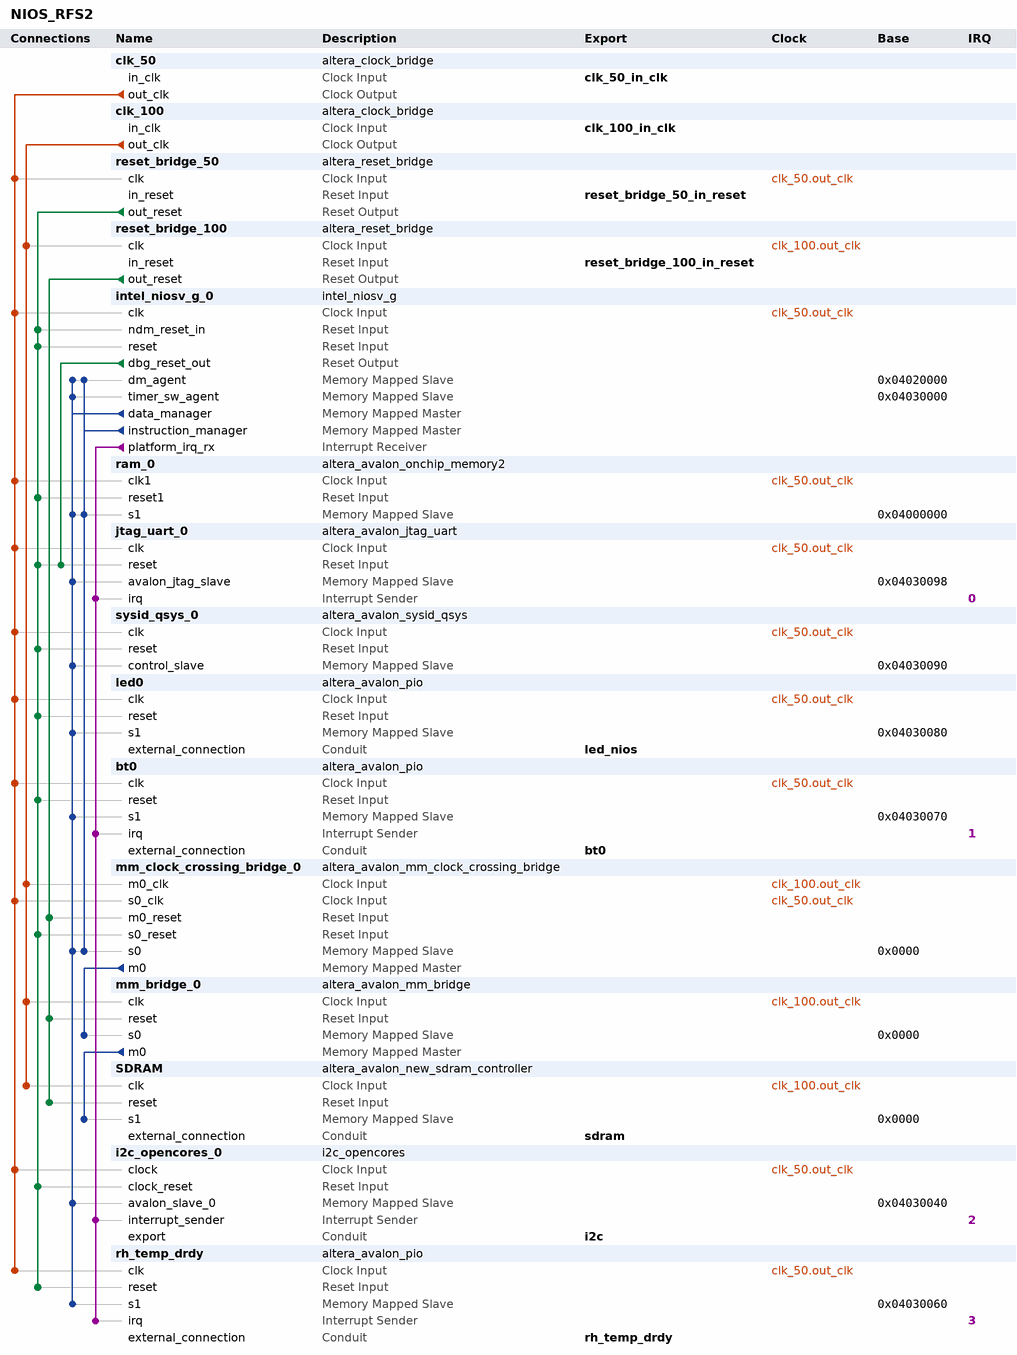
[diagram p0: system contents]
# Platform Designer (Qsys) system NIOS_RFS2, MAX 10 10M50DAF484C7G
# Parameters at their usual value, and those the tool derives, are not listed.
package require -exact qsys 24.1
create_system NIOS_RFS2
set_project_property DEVICE_FAMILY {MAX 10}
set_project_property DEVICE 10M50DAF484C7G

add_instance clk_50 altera_clock_bridge 24.1
set_instance_parameter_value clk_50 DERIVED_CLOCK_RATE 0
set_instance_parameter_value clk_50 EXPLICIT_CLOCK_RATE 50000000

add_instance clk_100 altera_clock_bridge 24.1
set_instance_parameter_value clk_100 DERIVED_CLOCK_RATE 0
set_instance_parameter_value clk_100 EXPLICIT_CLOCK_RATE 100000000

add_instance reset_bridge_50 altera_reset_bridge 24.1
set_instance_parameter_value reset_bridge_50 ACTIVE_LOW_RESET 1
set_instance_parameter_value reset_bridge_50 SYNCHRONOUS_EDGES deassert

add_instance reset_bridge_100 altera_reset_bridge 24.1
set_instance_parameter_value reset_bridge_100 ACTIVE_LOW_RESET 1
set_instance_parameter_value reset_bridge_100 SYNCHRONOUS_EDGES deassert

add_instance intel_niosv_g_0 intel_niosv_g 4.0.0
set_instance_parameter_value intel_niosv_g_0 Blind_Window_Period 1000
set_instance_parameter_value intel_niosv_g_0 CLICenabledInterruptMode 0
set_instance_parameter_value intel_niosv_g_0 CLICenabledShadowRegisterFiles 1
set_instance_parameter_value intel_niosv_g_0 Default_Timeout_Period 255
set_instance_parameter_value intel_niosv_g_0 alignCLICVectorTable 8
set_instance_parameter_value intel_niosv_g_0 basicInterruptMode 0
set_instance_parameter_value intel_niosv_g_0 basicShadowRegisterFiles 0
set_instance_parameter_value intel_niosv_g_0 clockFrequency 50000000
set_instance_parameter_value intel_niosv_g_0 dataCacheSize 4096
set_instance_parameter_value intel_niosv_g_0 disableFsqrtFdiv false
set_instance_parameter_value intel_niosv_g_0 dtcm1Base 0
set_instance_parameter_value intel_niosv_g_0 dtcm1Size 0
set_instance_parameter_value intel_niosv_g_0 dtcm2Base 0
set_instance_parameter_value intel_niosv_g_0 dtcm2Size 0
set_instance_parameter_value intel_niosv_g_0 enableBranchPrediction true
set_instance_parameter_value intel_niosv_g_0 enableCLICInterruptEdgeTriggerConfig false
set_instance_parameter_value intel_niosv_g_0 enableCLICInterruptPolarityConfig false
set_instance_parameter_value intel_niosv_g_0 enableCLICSelectiveHardwareVectoring false
set_instance_parameter_value intel_niosv_g_0 enableCoreLevelInterruptController false
set_instance_parameter_value intel_niosv_g_0 enableDebug true
set_instance_parameter_value intel_niosv_g_0 enableDebugReset true
set_instance_parameter_value intel_niosv_g_0 enableECCFull false
set_instance_parameter_value intel_niosv_g_0 enableECCLite false
set_instance_parameter_value intel_niosv_g_0 enableFPU false
set_instance_parameter_value intel_niosv_g_0 enableLockstep false
set_instance_parameter_value intel_niosv_g_0 enableLockstepExtRst false
set_instance_parameter_value intel_niosv_g_0 enableMulDiv true
set_instance_parameter_value intel_niosv_g_0 hartId 0
set_instance_parameter_value intel_niosv_g_0 instCacheSize 4096
set_instance_parameter_value intel_niosv_g_0 itcm1Base 0
set_instance_parameter_value intel_niosv_g_0 itcm1Size 0
set_instance_parameter_value intel_niosv_g_0 itcm2Base 0
set_instance_parameter_value intel_niosv_g_0 itcm2Size 0
set_instance_parameter_value intel_niosv_g_0 numCLICDebugTriggers 0
set_instance_parameter_value intel_niosv_g_0 numCLICLevels 2
set_instance_parameter_value intel_niosv_g_0 numCLICPlatformInterrupts 16
set_instance_parameter_value intel_niosv_g_0 numCLICPriorities 8
set_instance_parameter_value intel_niosv_g_0 peripheralRegionABase 0
set_instance_parameter_value intel_niosv_g_0 peripheralRegionASize 0
set_instance_parameter_value intel_niosv_g_0 peripheralRegionBBase 0
set_instance_parameter_value intel_niosv_g_0 peripheralRegionBSize 0
set_instance_parameter_value intel_niosv_g_0 resetOffset 0
set_instance_parameter_value intel_niosv_g_0 resetSlave SDRAM.s1
set_instance_parameter_value intel_niosv_g_0 useResetReq false

add_instance ram_0 altera_avalon_onchip_memory2 24.1
set_instance_parameter_value ram_0 dataWidth 32
set_instance_parameter_value ram_0 dualPort false
set_instance_parameter_value ram_0 initMemContent true
set_instance_parameter_value ram_0 initializationFileName onchip_mem.hex
set_instance_parameter_value ram_0 memorySize 131072

add_instance jtag_uart_0 altera_avalon_jtag_uart 24.1
set_instance_parameter_value jtag_uart_0 simInteractiveOptions NO_INTERACTIVE_WINDOWS

add_instance sysid_qsys_0 altera_avalon_sysid_qsys 24.1
set_instance_parameter_value sysid_qsys_0 id 0

add_instance led0 altera_avalon_pio 24.1
set_instance_parameter_value led0 direction Output
set_instance_parameter_value led0 width 10

add_instance bt0 altera_avalon_pio 24.1
set_instance_parameter_value bt0 captureEdge true
set_instance_parameter_value bt0 direction Input
set_instance_parameter_value bt0 edgeType FALLING
set_instance_parameter_value bt0 generateIRQ true
set_instance_parameter_value bt0 irqType EDGE
set_instance_parameter_value bt0 width 1

add_instance mm_clock_crossing_bridge_0 altera_avalon_mm_clock_crossing_bridge 24.1
set_instance_parameter_value mm_clock_crossing_bridge_0 ADDRESS_WIDTH 10
set_instance_parameter_value mm_clock_crossing_bridge_0 COMMAND_FIFO_DEPTH 64
set_instance_parameter_value mm_clock_crossing_bridge_0 DATA_WIDTH 32
set_instance_parameter_value mm_clock_crossing_bridge_0 MASTER_SYNC_DEPTH 2
set_instance_parameter_value mm_clock_crossing_bridge_0 MAX_BURST_SIZE 1
set_instance_parameter_value mm_clock_crossing_bridge_0 RESPONSE_FIFO_DEPTH 64
set_instance_parameter_value mm_clock_crossing_bridge_0 SLAVE_SYNC_DEPTH 2
set_instance_parameter_value mm_clock_crossing_bridge_0 USE_AUTO_ADDRESS_WIDTH 1

add_instance mm_bridge_0 altera_avalon_mm_bridge 24.1
set_instance_parameter_value mm_bridge_0 ADDRESS_UNITS SYMBOLS
set_instance_parameter_value mm_bridge_0 ADDRESS_WIDTH 26
set_instance_parameter_value mm_bridge_0 DATA_WIDTH 32
set_instance_parameter_value mm_bridge_0 MAX_PENDING_RESPONSES 4
set_instance_parameter_value mm_bridge_0 USE_AUTO_ADDRESS_WIDTH 0

add_instance SDRAM altera_avalon_new_sdram_controller 24.1
set_instance_parameter_value SDRAM TAC 5.4
set_instance_parameter_value SDRAM TRCD 15.0
set_instance_parameter_value SDRAM TRP 15.0
set_instance_parameter_value SDRAM casLatency 3
set_instance_parameter_value SDRAM columnWidth 10
set_instance_parameter_value SDRAM dataWidth 16
set_instance_parameter_value SDRAM generateSimulationModel false
set_instance_parameter_value SDRAM model single_Micron_MT48LC4M32B2_7_chip
set_instance_parameter_value SDRAM numberOfBanks 4
set_instance_parameter_value SDRAM numberOfChipSelects 1
set_instance_parameter_value SDRAM powerUpDelay 100.0
set_instance_parameter_value SDRAM refreshPeriod 7.8125
set_instance_parameter_value SDRAM rowWidth 13

add_instance i2c_opencores_0 i2c_opencores 12.0

add_instance rh_temp_drdy altera_avalon_pio 24.1
set_instance_parameter_value rh_temp_drdy captureEdge true
set_instance_parameter_value rh_temp_drdy direction Input
set_instance_parameter_value rh_temp_drdy edgeType FALLING
set_instance_parameter_value rh_temp_drdy generateIRQ true
set_instance_parameter_value rh_temp_drdy irqType EDGE
set_instance_parameter_value rh_temp_drdy width 1

# connections
add_connection clk_50.out_clk bt0.clk clock
add_connection clk_50.out_clk i2c_opencores_0.clock clock
add_connection clk_50.out_clk intel_niosv_g_0.clk clock
add_connection clk_50.out_clk jtag_uart_0.clk clock
add_connection clk_50.out_clk led0.clk clock
add_connection clk_50.out_clk mm_clock_crossing_bridge_0.s0_clk clock
add_connection clk_50.out_clk ram_0.clk1 clock
add_connection clk_50.out_clk reset_bridge_50.clk clock
add_connection clk_50.out_clk rh_temp_drdy.clk clock
add_connection clk_50.out_clk sysid_qsys_0.clk clock
add_connection clk_100.out_clk mm_bridge_0.clk clock
add_connection clk_100.out_clk mm_clock_crossing_bridge_0.m0_clk clock
add_connection clk_100.out_clk reset_bridge_100.clk clock
add_connection clk_100.out_clk SDRAM.clk clock
add_connection intel_niosv_g_0.dbg_reset_out jtag_uart_0.reset reset
add_connection reset_bridge_50.out_reset bt0.reset reset
add_connection reset_bridge_50.out_reset i2c_opencores_0.clock_reset reset
add_connection reset_bridge_50.out_reset intel_niosv_g_0.ndm_reset_in reset
add_connection reset_bridge_50.out_reset intel_niosv_g_0.reset reset
add_connection reset_bridge_50.out_reset jtag_uart_0.reset reset
add_connection reset_bridge_50.out_reset led0.reset reset
add_connection reset_bridge_50.out_reset mm_clock_crossing_bridge_0.s0_reset reset
add_connection reset_bridge_50.out_reset ram_0.reset1 reset
add_connection reset_bridge_50.out_reset rh_temp_drdy.reset reset
add_connection reset_bridge_50.out_reset sysid_qsys_0.reset reset
add_connection reset_bridge_100.out_reset mm_bridge_0.reset reset
add_connection reset_bridge_100.out_reset mm_clock_crossing_bridge_0.m0_reset reset
add_connection reset_bridge_100.out_reset SDRAM.reset reset
add_connection intel_niosv_g_0.data_manager bt0.s1 avalon
set_connection_parameter_value intel_niosv_g_0.data_manager/bt0.s1 baseAddress 0x04030070
add_connection intel_niosv_g_0.data_manager i2c_opencores_0.avalon_slave_0 avalon
set_connection_parameter_value intel_niosv_g_0.data_manager/i2c_opencores_0.avalon_slave_0 baseAddress 0x04030040
add_connection intel_niosv_g_0.data_manager intel_niosv_g_0.dm_agent avalon
set_connection_parameter_value intel_niosv_g_0.data_manager/intel_niosv_g_0.dm_agent baseAddress 0x04020000
add_connection intel_niosv_g_0.data_manager intel_niosv_g_0.timer_sw_agent avalon
set_connection_parameter_value intel_niosv_g_0.data_manager/intel_niosv_g_0.timer_sw_agent baseAddress 0x04030000
add_connection intel_niosv_g_0.data_manager jtag_uart_0.avalon_jtag_slave avalon
set_connection_parameter_value intel_niosv_g_0.data_manager/jtag_uart_0.avalon_jtag_slave baseAddress 0x04030098
add_connection intel_niosv_g_0.data_manager led0.s1 avalon
set_connection_parameter_value intel_niosv_g_0.data_manager/led0.s1 baseAddress 0x04030080
add_connection intel_niosv_g_0.data_manager mm_clock_crossing_bridge_0.s0 avalon
set_connection_parameter_value intel_niosv_g_0.data_manager/mm_clock_crossing_bridge_0.s0 baseAddress 0x0000
add_connection intel_niosv_g_0.data_manager ram_0.s1 avalon
set_connection_parameter_value intel_niosv_g_0.data_manager/ram_0.s1 baseAddress 0x04000000
add_connection intel_niosv_g_0.data_manager rh_temp_drdy.s1 avalon
set_connection_parameter_value intel_niosv_g_0.data_manager/rh_temp_drdy.s1 baseAddress 0x04030060
add_connection intel_niosv_g_0.data_manager sysid_qsys_0.control_slave avalon
set_connection_parameter_value intel_niosv_g_0.data_manager/sysid_qsys_0.control_slave baseAddress 0x04030090
add_connection intel_niosv_g_0.instruction_manager intel_niosv_g_0.dm_agent avalon
set_connection_parameter_value intel_niosv_g_0.instruction_manager/intel_niosv_g_0.dm_agent baseAddress 0x04020000
add_connection intel_niosv_g_0.instruction_manager mm_clock_crossing_bridge_0.s0 avalon
set_connection_parameter_value intel_niosv_g_0.instruction_manager/mm_clock_crossing_bridge_0.s0 baseAddress 0x0000
add_connection intel_niosv_g_0.instruction_manager ram_0.s1 avalon
set_connection_parameter_value intel_niosv_g_0.instruction_manager/ram_0.s1 baseAddress 0x04000000
add_connection mm_bridge_0.m0 SDRAM.s1 avalon
set_connection_parameter_value mm_bridge_0.m0/SDRAM.s1 baseAddress 0x0000
add_connection mm_clock_crossing_bridge_0.m0 mm_bridge_0.s0 avalon
set_connection_parameter_value mm_clock_crossing_bridge_0.m0/mm_bridge_0.s0 baseAddress 0x0000
add_connection intel_niosv_g_0.platform_irq_rx bt0.irq interrupt
set_connection_parameter_value intel_niosv_g_0.platform_irq_rx/bt0.irq irqNumber 1
add_connection intel_niosv_g_0.platform_irq_rx i2c_opencores_0.interrupt_sender interrupt
set_connection_parameter_value intel_niosv_g_0.platform_irq_rx/i2c_opencores_0.interrupt_sender irqNumber 2
add_connection intel_niosv_g_0.platform_irq_rx jtag_uart_0.irq interrupt
set_connection_parameter_value intel_niosv_g_0.platform_irq_rx/jtag_uart_0.irq irqNumber 0
add_connection intel_niosv_g_0.platform_irq_rx rh_temp_drdy.irq interrupt
set_connection_parameter_value intel_niosv_g_0.platform_irq_rx/rh_temp_drdy.irq irqNumber 3

# exported interfaces
add_interface bt0 conduit end
set_interface_property bt0 EXPORT_OF bt0.external_connection
add_interface clk_100_in_clk clock sink
set_interface_property clk_100_in_clk EXPORT_OF clk_100.in_clk
add_interface clk_50_in_clk clock sink
set_interface_property clk_50_in_clk EXPORT_OF clk_50.in_clk
add_interface i2c conduit end
set_interface_property i2c EXPORT_OF i2c_opencores_0.export
add_interface led_nios conduit end
set_interface_property led_nios EXPORT_OF led0.external_connection
add_interface reset_bridge_100_in_reset reset sink
set_interface_property reset_bridge_100_in_reset EXPORT_OF reset_bridge_100.in_reset
add_interface reset_bridge_50_in_reset reset sink
set_interface_property reset_bridge_50_in_reset EXPORT_OF reset_bridge_50.in_reset
add_interface rh_temp_drdy conduit end
set_interface_property rh_temp_drdy EXPORT_OF rh_temp_drdy.external_connection
add_interface sdram conduit end
set_interface_property sdram EXPORT_OF SDRAM.external_connection

set_interconnect_requirement {$system} qsys_mm.clockCrossingAdapter HANDSHAKE
set_interconnect_requirement {$system} qsys_mm.enableEccProtection FALSE
set_interconnect_requirement {$system} qsys_mm.insertDefaultSlave FALSE
set_interconnect_requirement {$system} qsys_mm.maxAdditionalLatency 1

save_system NIOS_RFS2.qsys
